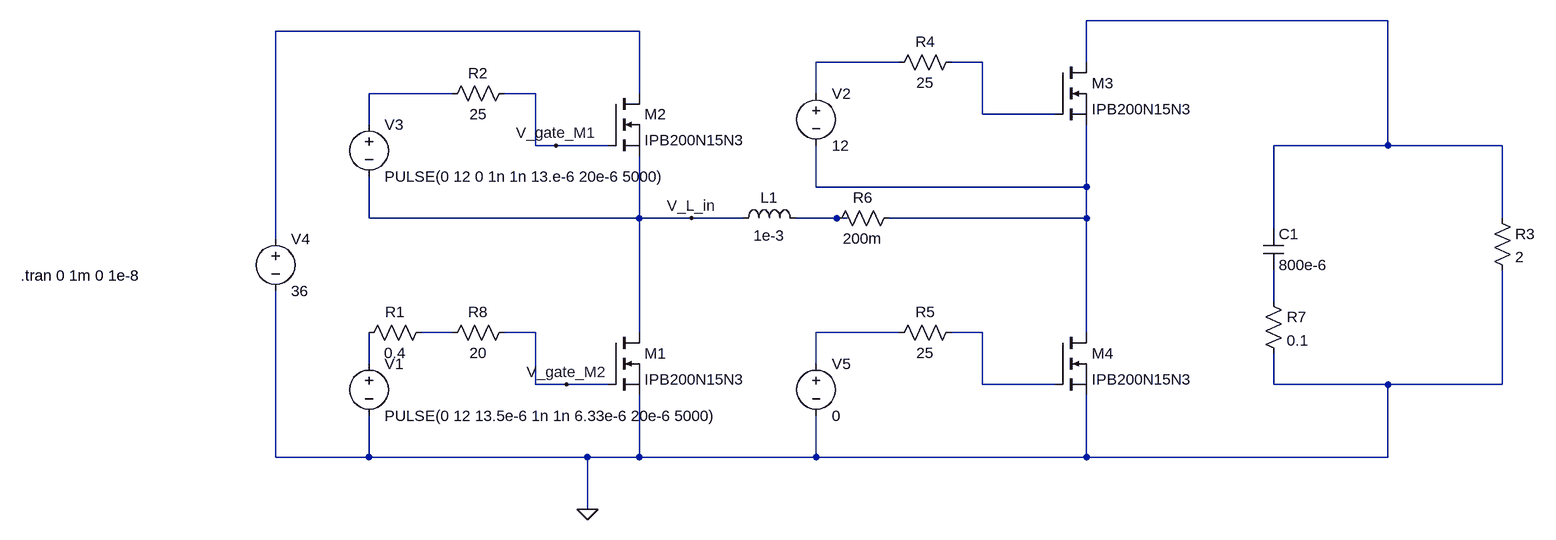
[diagram p0: schematic MOSFET_buck.asc]
MOSFET_buck.asc, the LTspice schematic file:
Version 4
SHEET 1 1832 680
WIRE 1600 -400 1136 -400
WIRE 448 -384 -112 -384
WIRE 848 -336 720 -336
WIRE 976 -336 928 -336
WIRE 1136 -336 1136 -400
WIRE 160 -288 32 -288
WIRE 288 -288 240 -288
WIRE 448 -288 448 -384
WIRE 720 -288 720 -336
WIRE 976 -256 976 -336
WIRE 1088 -256 976 -256
WIRE 32 -240 32 -288
WIRE 288 -208 288 -288
WIRE 320 -208 288 -208
WIRE 400 -208 320 -208
WIRE 1600 -208 1600 -400
WIRE 1600 -208 1424 -208
WIRE 1776 -208 1600 -208
WIRE 720 -144 720 -208
WIRE 1136 -144 1136 -240
WIRE 1136 -144 720 -144
WIRE 32 -96 32 -160
WIRE 448 -96 448 -192
WIRE 448 -96 32 -96
WIRE 528 -96 448 -96
WIRE 608 -96 528 -96
WIRE 752 -96 688 -96
WIRE 768 -96 752 -96
WIRE 1136 -96 1136 -144
WIRE 1136 -96 832 -96
WIRE 1776 -96 1776 -208
WIRE 1424 -80 1424 -208
WIRE -112 -64 -112 -384
WIRE 1424 32 1424 -16
WIRE 160 80 112 80
WIRE 288 80 240 80
WIRE 448 80 448 -96
WIRE 848 80 720 80
WIRE 976 80 928 80
WIRE 1136 80 1136 -96
WIRE 32 128 32 80
WIRE 720 128 720 80
WIRE 288 160 288 80
WIRE 336 160 288 160
WIRE 400 160 336 160
WIRE 976 160 976 80
WIRE 1088 160 976 160
WIRE 1424 160 1424 112
WIRE 1600 160 1424 160
WIRE 1776 160 1776 -16
WIRE 1776 160 1600 160
WIRE -112 272 -112 16
WIRE 32 272 32 208
WIRE 32 272 -112 272
WIRE 368 272 32 272
WIRE 448 272 448 176
WIRE 448 272 368 272
WIRE 720 272 720 208
WIRE 720 272 448 272
WIRE 1136 272 1136 176
WIRE 1136 272 720 272
WIRE 1600 272 1600 160
WIRE 1600 272 1136 272
WIRE 368 352 368 272
FLAG 368 352 0
FLAG 336 160 V_gate_M2
FLAG 528 -96 V_L_in
FLAG 320 -208 V_gate_M1
SYMBOL voltage 32 112 R0
WINDOW 123 0 0 Left 0
WINDOW 39 0 0 Left 0
SYMATTR InstName V1
SYMATTR Value PULSE(0 12 13.5e-6 1n 1n 6.33e-6 20e-6 5000)
SYMBOL nmos 400 80 R0
SYMATTR InstName M1
SYMATTR Value IPB200N15N3
SYMBOL voltage 32 -256 R0
WINDOW 123 0 0 Left 0
WINDOW 39 0 0 Left 0
SYMATTR InstName V3
SYMATTR Value PULSE(0 12 0 1n 1n 13.e-6 20e-6 5000)
SYMBOL nmos 400 -288 R0
SYMATTR InstName M2
SYMATTR Value IPB200N15N3
SYMBOL res 256 -304 R90
WINDOW 0 0 56 VBottom 2
WINDOW 3 32 56 VTop 2
SYMATTR InstName R2
SYMATTR Value 25
SYMBOL voltage -112 -80 R0
WINDOW 123 0 0 Left 0
WINDOW 39 0 0 Left 0
SYMATTR InstName V4
SYMATTR Value 36
SYMBOL cap 1408 -80 R0
SYMATTR InstName C1
SYMATTR Value 800e-6
SYMBOL ind 592 -80 R270
WINDOW 0 32 56 VTop 2
WINDOW 3 5 56 VBottom 2
SYMATTR InstName L1
SYMATTR Value 1e-3
SYMBOL res 1760 -112 R0
SYMATTR InstName R3
SYMATTR Value 2
SYMBOL voltage 720 -304 R0
WINDOW 123 0 0 Left 0
WINDOW 39 0 0 Left 0
SYMATTR InstName V2
SYMATTR Value 12
SYMBOL nmos 1088 -336 R0
SYMATTR InstName M3
SYMATTR Value IPB200N15N3
SYMBOL res 944 -352 R90
WINDOW 0 0 56 VBottom 2
WINDOW 3 32 56 VTop 2
SYMATTR InstName R4
SYMATTR Value 25
SYMBOL voltage 720 112 R0
WINDOW 123 0 0 Left 0
WINDOW 39 0 0 Left 0
SYMATTR InstName V5
SYMATTR Value 0
SYMBOL nmos 1088 80 R0
SYMATTR InstName M4
SYMATTR Value IPB200N15N3
SYMBOL res 944 64 R90
WINDOW 0 0 56 VBottom 2
WINDOW 3 32 56 VTop 2
SYMATTR InstName R5
SYMATTR Value 25
SYMBOL res 848 -112 R90
WINDOW 0 0 56 VBottom 2
WINDOW 3 32 56 VTop 2
SYMATTR InstName R6
SYMATTR Value 200m
SYMBOL res 1408 16 R0
SYMATTR InstName R7
SYMATTR Value 0.1
SYMBOL res 128 64 R90
WINDOW 0 0 56 VBottom 2
WINDOW 3 32 56 VTop 2
SYMATTR InstName R1
SYMATTR Value 0.4
SYMBOL res 256 64 R90
WINDOW 0 0 56 VBottom 2
WINDOW 3 32 56 VTop 2
SYMATTR InstName R8
SYMATTR Value 20
TEXT -504 -8 Left 2 !.tran 0 1m 0 1e-8

The netlist it stands for:
* MOSFET_buck.asc
V1 N012 0 PULSE(0 12 13.5e-6 1n 1n 6.33e-6 20e-6 5000)
M1 V_L_in V_gate_M2 0 0 IPB200N15N3
V3 N005 V_L_in PULSE(0 12 0 1n 1n 13.e-6 20e-6 5000)
M2 N002 V_gate_M1 V_L_in V_L_in IPB200N15N3
R2 V_gate_M1 N005 25
V4 N002 0 36
C1 N001 N008 800e-6
L1 V_L_in N007 1e-3
R3 N001 0 2
V2 N003 N006 12
M3 N001 N004 N006 N006 IPB200N15N3
R4 N004 N003 25
V5 N010 0 0
M4 N006 N011 0 0 IPB200N15N3
R5 N011 N010 25
R6 N006 N007 200m
R7 N008 0 0.1
R1 N009 N012 0.4
R8 V_gate_M2 N009 20
.model NMOS NMOS
.model PMOS PMOS
.lib standard.mos
.tran 0 1m 0 1e-8
.backanno
.end